# Altium schematic sheet kijelzok.SchDoc
size A4
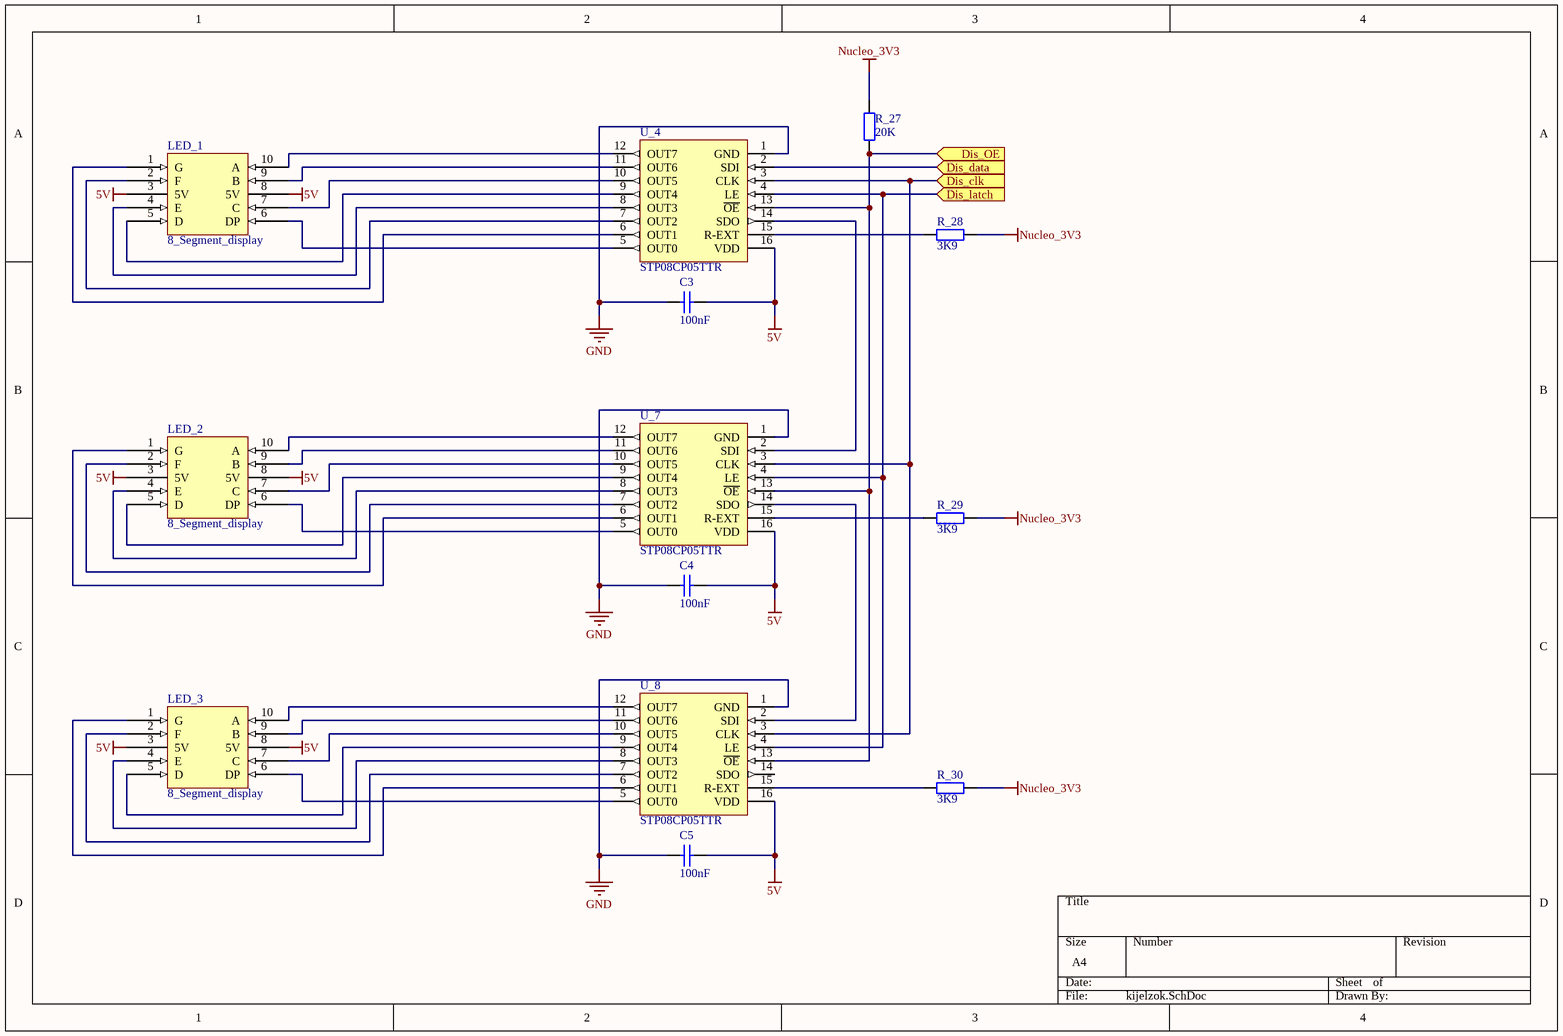
[diagram p0: kijelzok.SchDoc]

## Parts
C3  100nF  [FP_0402_CAP_050]
C4  100nF  [FP_0402_CAP_050]
C5  100nF  [FP_0402_CAP_050]
LED_1  8_Segment_display  [8 Segment Display]
LED_2  8_Segment_display  [8 Segment Display]
LED_3  8_Segment_display  [8 Segment Display]
R_27  20K  [FP_0603_RES]
R_28  3K9  [FP_0603_RES]
R_29  3K9  [FP_0603_RES]
R_30  3K9  [FP_0603_RES]
U_4  STP08CP05TTR  [SOP127P600-sajat_0095-015]
U_7  STP08CP05TTR  [SOP127P600-sajat_0095-015]
U_8  STP08CP05TTR  [SOP127P600-sajat_0095-015]

## Ports
Dis_clk (in), Dis_data (in), Dis_latch (in), Dis_OE (in)

## Nets
5V: C3.2 C4.2 C5.2 LED_1.3(5V) LED_1.8(5V) LED_2.3(5V) LED_2.8(5V) LED_3.3(5V) LED_3.8(5V) U_4.16(VDD) U_7.16(VDD) U_8.16(VDD)
GND: C3.1 C4.1 C5.1 U_4.1(GND) U_7.1(GND) U_8.1(GND)
Nucleo_3V3: R_27.2 R_28.2 R_29.2 R_30.2
Dis_clk: U_4.3(CLK) U_7.3(CLK) U_8.3(CLK) ; port Dis_clk
Dis_data: U_4.2(SDI) ; port Dis_data
Dis_latch: U_4.4(LE) U_7.4(LE) U_8.4(LE) ; port Dis_latch
Dis_OE: R_27.1 U_4.13(~{OE}) U_7.13(~{OE}) U_8.13(~{OE}) ; port Dis_OE
NetLED_1_1: LED_1.1(G) U_4.6(OUT1)
NetLED_1_2: LED_1.2(F) U_4.7(OUT2)
NetLED_1_4: LED_1.4(E) U_4.8(OUT3)
NetLED_1_5: LED_1.5(D) U_4.9(OUT4)
NetLED_1_6: LED_1.6(DP) U_4.5(OUT0)
NetLED_1_7: LED_1.7(C) U_4.10(OUT5)
NetLED_1_9: LED_1.9(B) U_4.11(OUT6)
NetLED_1_10: LED_1.10(A) U_4.12(OUT7)
NetLED_2_1: LED_2.1(G) U_7.6(OUT1)
NetLED_2_2: LED_2.2(F) U_7.7(OUT2)
NetLED_2_4: LED_2.4(E) U_7.8(OUT3)
NetLED_2_5: LED_2.5(D) U_7.9(OUT4)
NetLED_2_6: LED_2.6(DP) U_7.5(OUT0)
NetLED_2_7: LED_2.7(C) U_7.10(OUT5)
NetLED_2_9: LED_2.9(B) U_7.11(OUT6)
NetLED_2_10: LED_2.10(A) U_7.12(OUT7)
NetLED_3_1: LED_3.1(G) U_8.6(OUT1)
NetLED_3_2: LED_3.2(F) U_8.7(OUT2)
NetLED_3_4: LED_3.4(E) U_8.8(OUT3)
NetLED_3_5: LED_3.5(D) U_8.9(OUT4)
NetLED_3_6: LED_3.6(DP) U_8.5(OUT0)
NetLED_3_7: LED_3.7(C) U_8.10(OUT5)
NetLED_3_9: LED_3.9(B) U_8.11(OUT6)
NetLED_3_10: LED_3.10(A) U_8.12(OUT7)
NetR_28_1: R_28.1 U_4.15(R-EXT)
NetR_29_1: R_29.1 U_7.15(R-EXT)
NetR_30_1: R_30.1 U_8.15(R-EXT)
NetU_4_14: U_4.14(SDO) U_7.2(SDI)
NetU_7_14: U_7.14(SDO) U_8.2(SDI)

Not connected (* = marked no-connect by the designer): U_8 14(SDO)

## Library data of the parts
C3-C5 = CAP: Capacitor; Value: 100nF
R_27-R_30 = RES: Resistor
  R_27: Value: 20K
  R_28-R_30: Value: 3K9
U_4 U_7 U_8 = STP08CP05TTR: Low voltage, low current power 8-bit shift register
LED_1-LED_3 = 8_Segment_display: Supplier: lomex; Reference: 35-03-94